# EAGLE design Basic_OCTA-MINI (EAGLE 8.1.0)

## Sheet 1 of 4
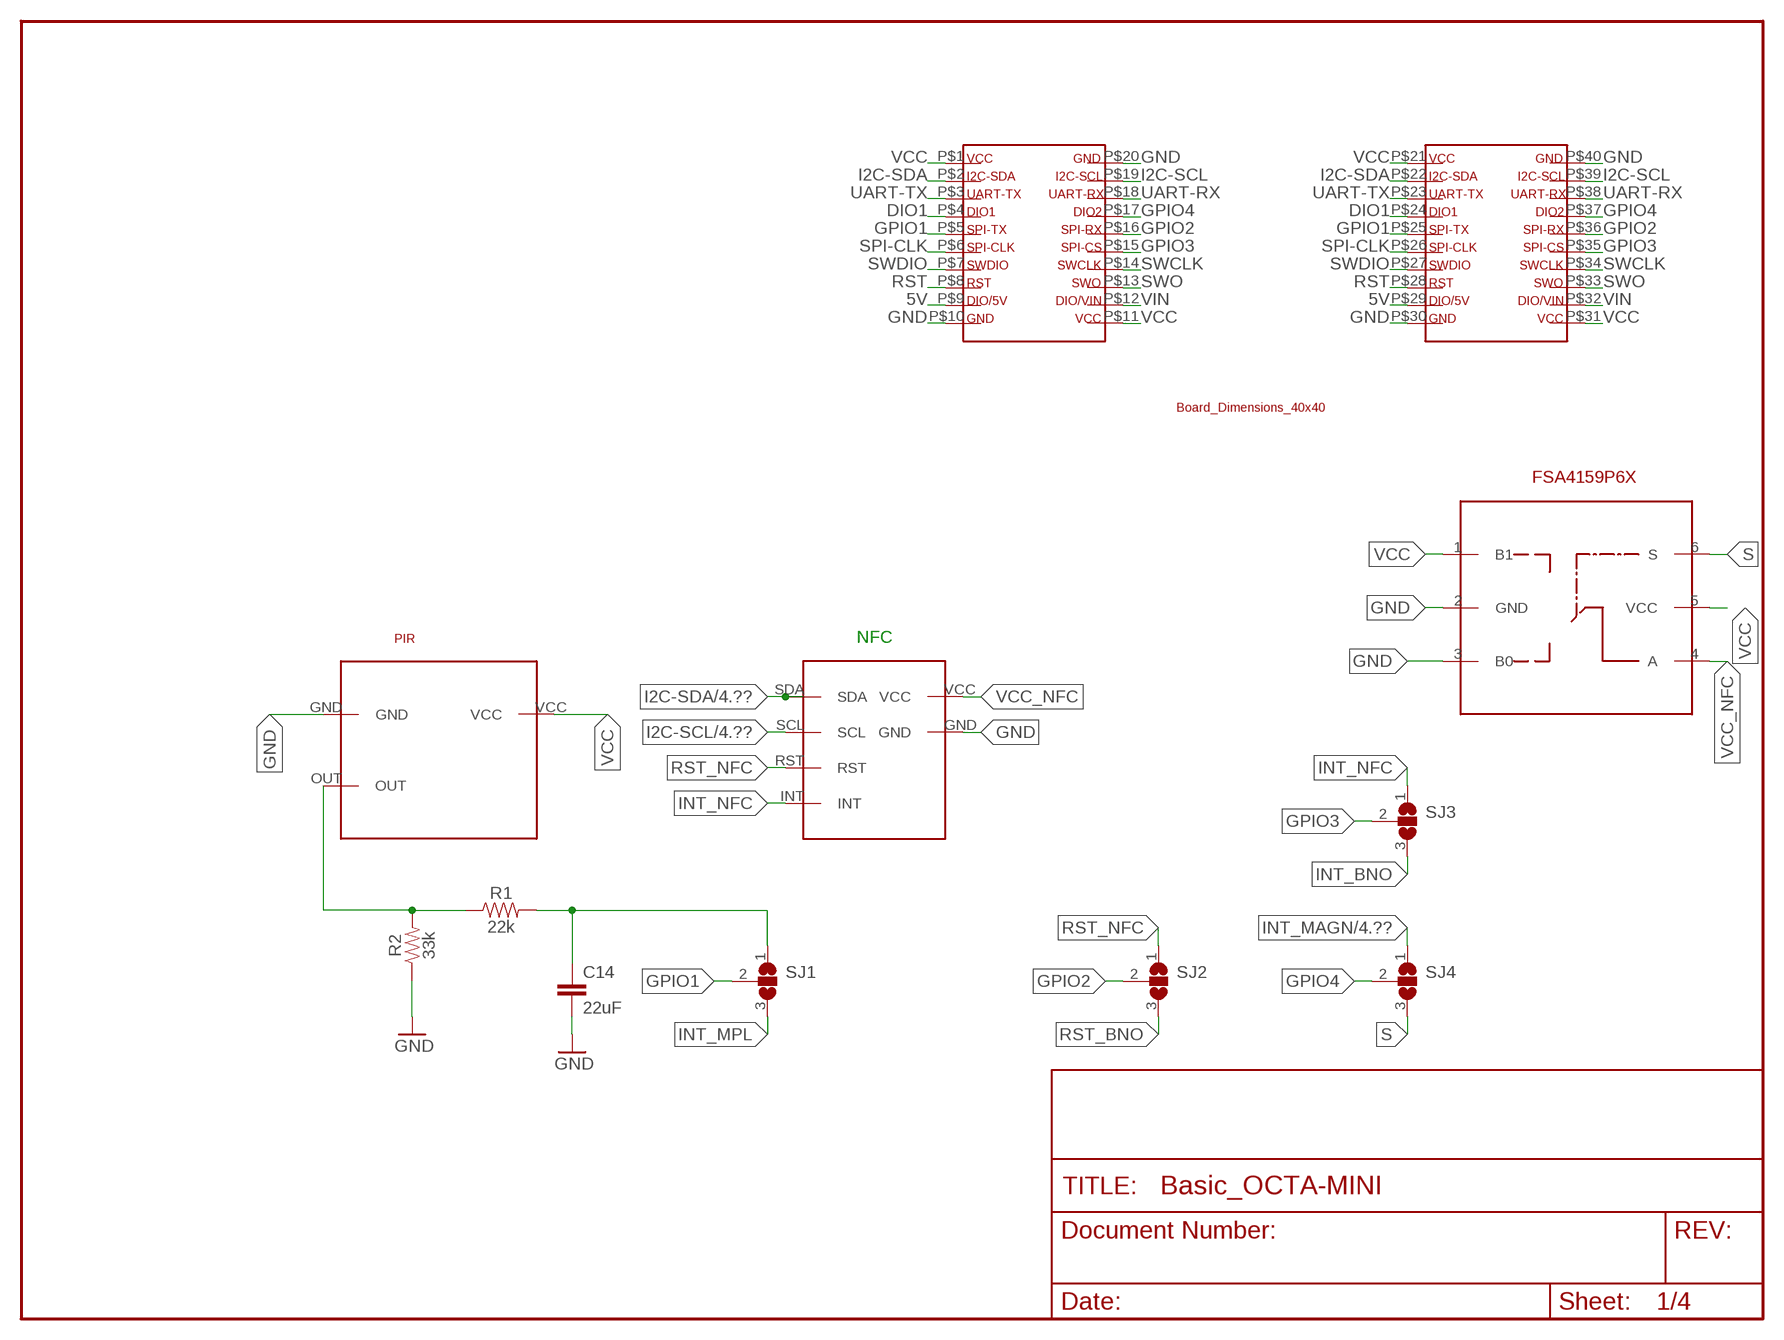
[diagram p0: schematic, sheet 1]

### Parts
C14  22uF  22UF-0805-6.3V-20%  [0805]
R1  22k  22KOHM-0603-1/10W-1%  [0603]
R2  33k  33KOHM-0603-1/10W-1%  [0603]
SJ1  SJ2W  [SJ_2]
SJ2  SJ2W  [SJ_2]
SJ3  SJ2W  [SJ_2]
SJ4  SJ2W  [SJ_2]
U$2  BOARD-DIMENSIONS-40X40  [BOARD-DIMENSIONS-40X40]
U$9  PIR  [PIR]
U$10  NFC  [NFC]
U$17  FSA4159P6X  [SOT65P210X100-6N]

### Nets
5V: U$2.P$9 U$2.P$29
DIO1: U$2.P$4 U$2.P$24
GND: C14.2 R2.1 U$2.P$10 U$2.P$20 U$2.P$30 U$2.P$40 U$9.GND U$10.GND U$17.2(GND) U$17.3(B0) ; also sheet 2,3,4
GPIO1: SJ1.2 U$2.P$5 U$2.P$25
GPIO2: SJ2.2 U$2.P$16 U$2.P$36
GPIO3: SJ3.2 U$2.P$15 U$2.P$35
GPIO4: SJ4.2 U$2.P$17 U$2.P$37
I2C-SCL: U$2.P$19 U$2.P$39 U$10.SCL ; also sheet 2,3,4
I2C-SDA: U$2.P$2 U$2.P$22 U$10.SDA ; also sheet 2,3,4
INT_BNO: SJ3.3 ; also sheet 2
INT_MAGN: SJ4.1 ; also sheet 4
INT_MPL: SJ1.3 ; also sheet 3
INT_NFC: SJ3.1 U$10.INT
N$7: R1.1 R2.2 U$9.OUT
OUT2_PIR: C14.1 R1.2 SJ1.1
RST: U$2.P$8 U$2.P$28
RST_BNO: SJ2.3 ; also sheet 2
RST_NFC: SJ2.1 U$10.RST
S: SJ4.3 U$17.6(S)
SPI-CLK: U$2.P$6 U$2.P$26
SWCLK: U$2.P$14 U$2.P$34
SWDIO: U$2.P$7 U$2.P$27
SWO: U$2.P$13 U$2.P$33
UART-RX: U$2.P$18 U$2.P$38
UART-TX: U$2.P$3 U$2.P$23
VCC: U$2.P$1 U$2.P$11 U$2.P$21 U$2.P$31 U$9.VCC U$17.1(B1) U$17.5(VCC) ; also sheet 2,3,4
VCC_NFC: U$10.VCC U$17.4(A)
VIN: U$2.P$12 U$2.P$32

### Notes on the sheet
- NFC

## Sheet 2 of 4
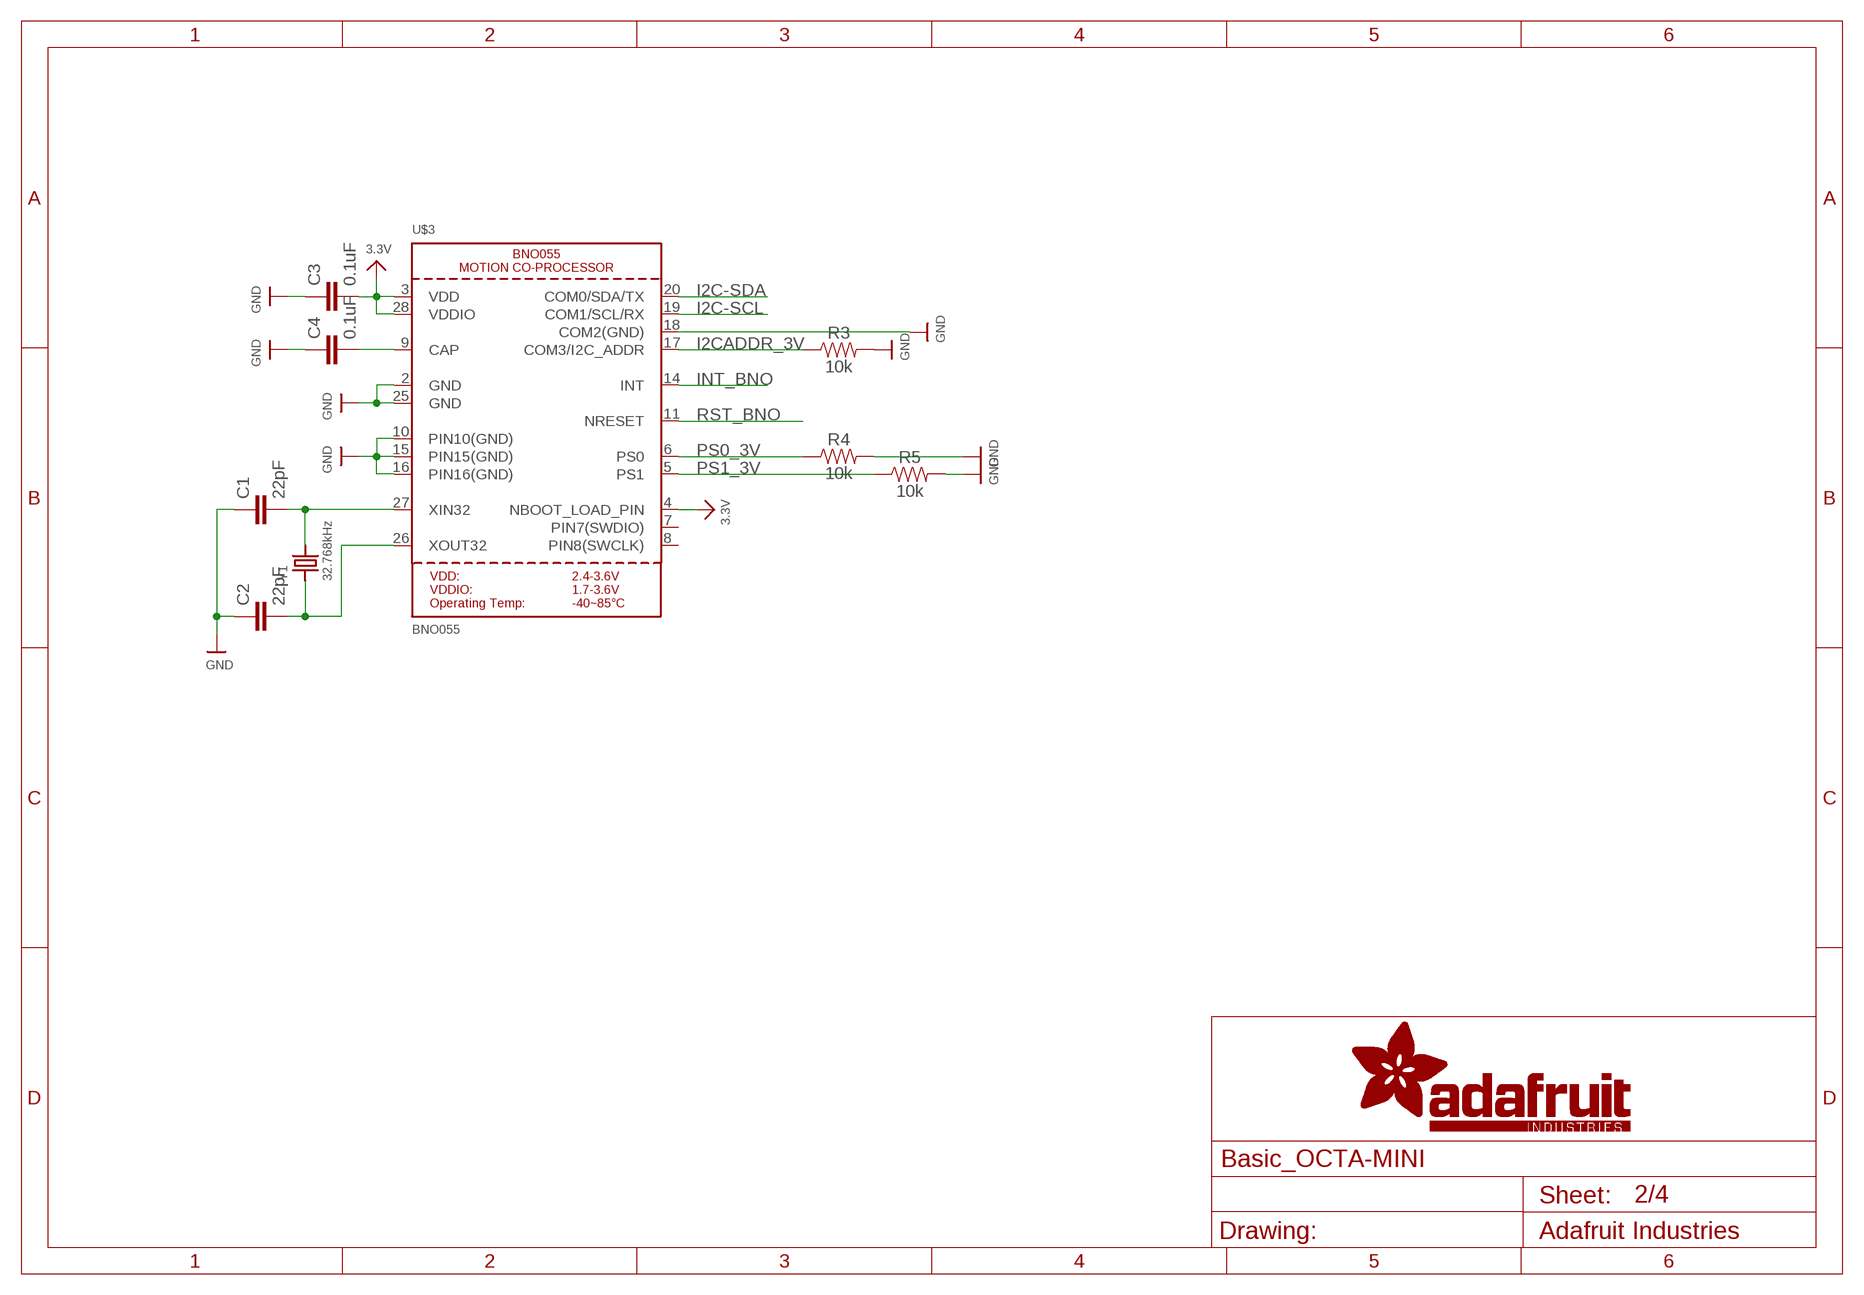
[diagram p1: schematic, sheet 2]

### Parts
C1  22pF  22PF-0603-50V-5%  [0603]
C2  22pF  22PF-0603-50V-5%  [0603]
C3  0.1uF  0.1UF-0603-25V-(+80/-20%)  [0603]
C4  0.1uF  0.1UF-0603-25V-(+80/-20%)  [0603]
R3  10k  10KOHM-0603-1/10W-1%  [0603]
R4  10k  10KOHM-0603-1/10W-1%  [0603]
R5  10k  10KOHM-0603-1/10W-1%  [0603]
U$3  BNO055  [BNO055]
Y1  32.768kHz  CRYSTAL8.0X3.8  [CRYSTAL_8X3.8]

### Nets
GND: C1.1 C2.1 C3.1 C4.1 R3.2 R4.2 R5.2 U$3.2(GND) U$3.10(PIN10(GND)) U$3.15(PIN15(GND)) U$3.16(PIN16(GND)) U$3.18(COM2(GND)) U$3.25(GND) ; also sheet 1,3,4
I2C-SCL: U$3.19(COM1/SCL/RX) ; also sheet 1,3,4
I2C-SDA: U$3.20(COM0/SDA/TX) ; also sheet 1,3,4
I2CADDR_3V: R3.1 U$3.17(COM3/I2C_ADDR)
INT_BNO: U$3.14(INT) ; also sheet 1
N$1: C1.2 U$3.27(XIN32) Y1.P$4
N$2: C2.2 U$3.26(XOUT32) Y1.P$1
N$3: C4.2 U$3.9(CAP)
PS0_3V: R4.1 U$3.6(PS0)
PS1_3V: R5.1 U$3.5(PS1)
RST_BNO: U$3.11(NRESET) ; also sheet 1
VCC: C3.2 U$3.3(VDD) U$3.4(NBOOT_LOAD_PIN) U$3.28(VDDIO) ; supply symbol labelled 3.3V ; also sheet 1,3,4
Unconnected: U$3.7(PIN7(SWDIO)) U$3.8(PIN8(SWCLK))

## Sheet 3 of 4
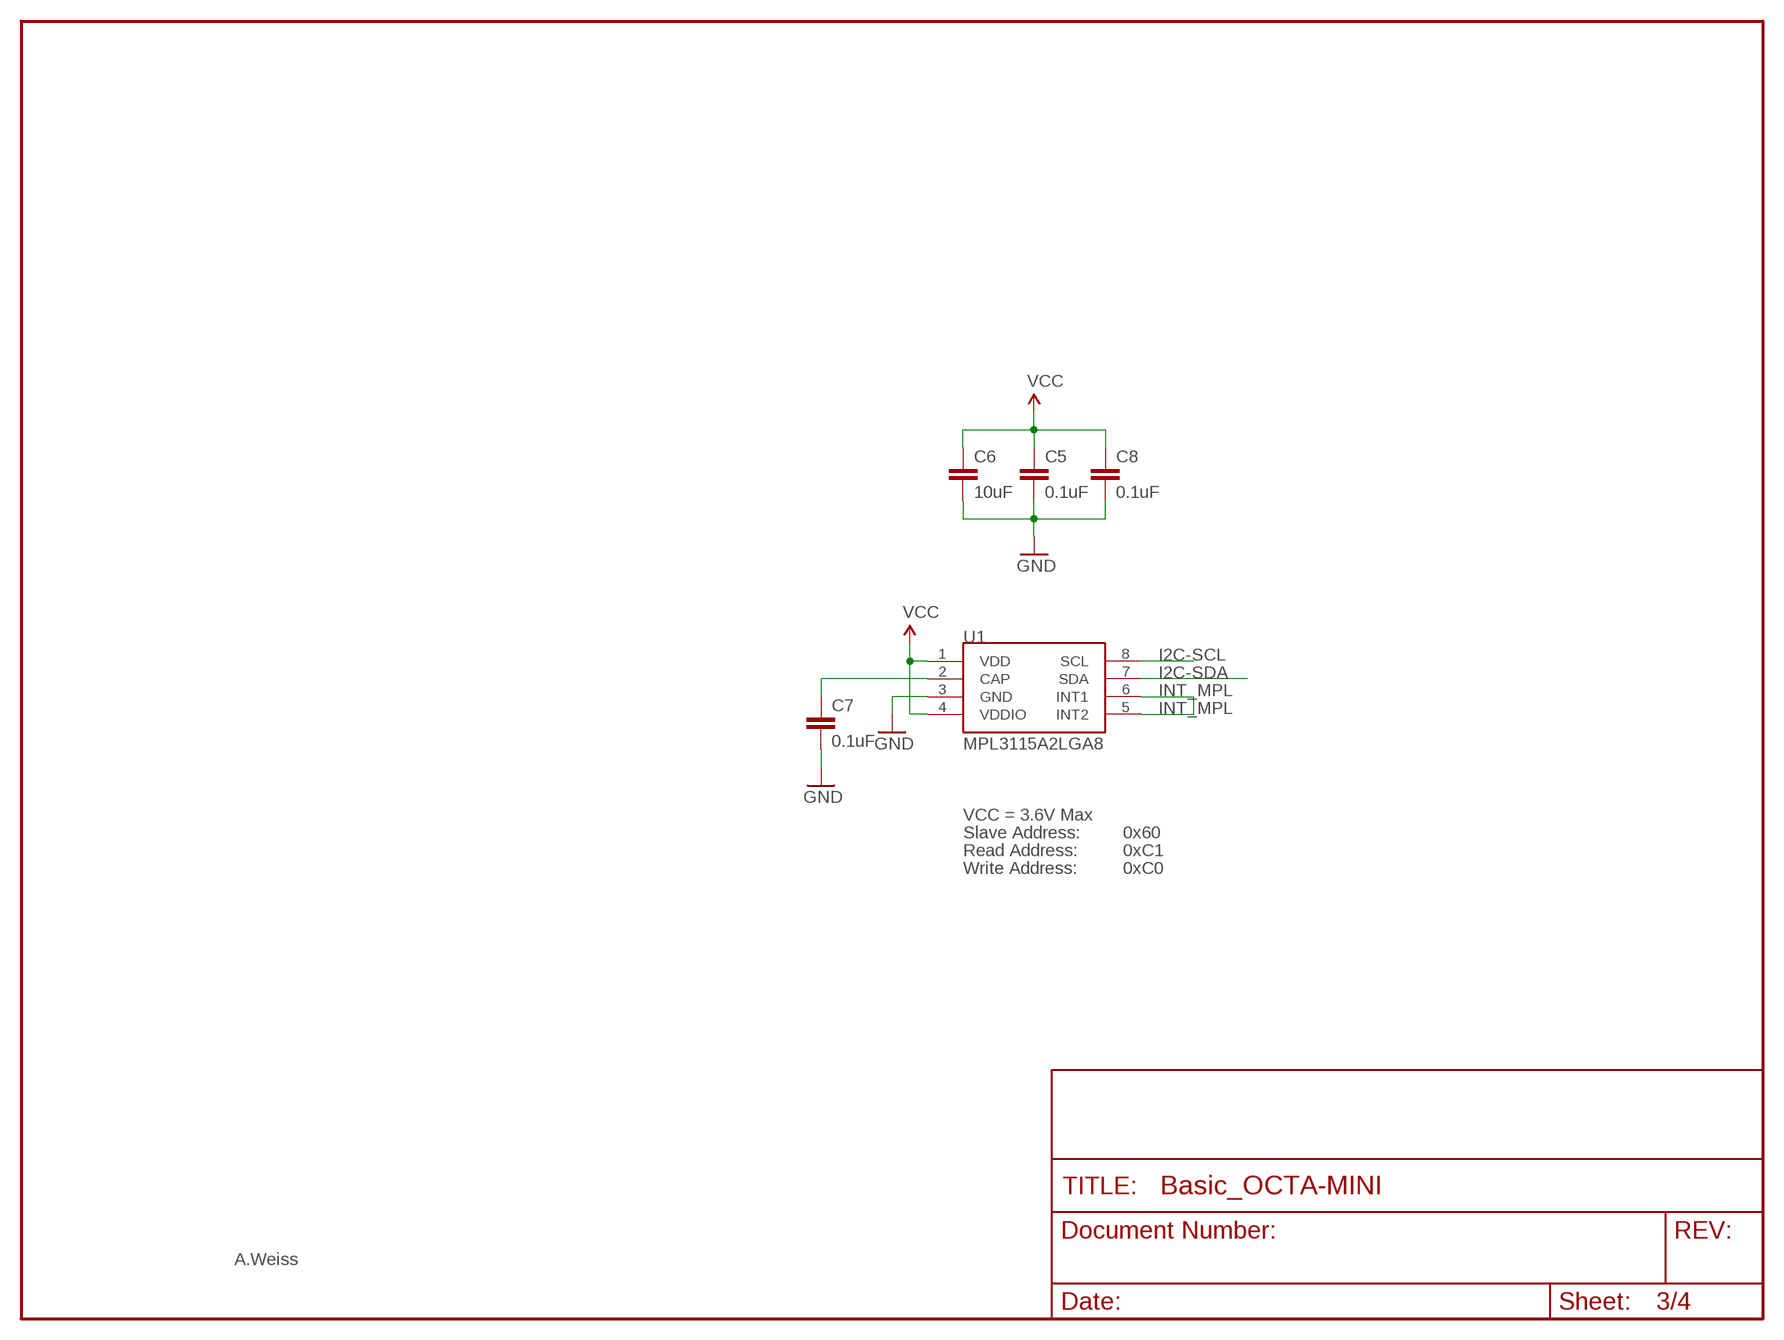
[diagram p2: schematic, sheet 3]

### Parts
C5  0.1uF  0.1UF-0603-25V-(+80/-20%)  [0603]
C6  10uF  10UF-0603-6.3V-20%  [0603]
C7  0.1uF  0.1UF-0603-25V-(+80/-20%)  [0603]
C8  0.1uF  0.1UF-0603-25V-(+80/-20%)  [0603]
U1  MPL3115A2LGA8  [LGA8]

### Nets
GND: C5.2 C6.2 C7.2 C8.2 U1.3(GND) ; also sheet 1,2,4
I2C-SCL: U1.8(SCL) ; also sheet 1,2,4
I2C-SDA: U1.7(SDA) ; also sheet 1,2,4
INT_MPL: U1.5(INT2) U1.6(INT1) ; also sheet 1
N$4: C7.1 U1.2(CAP)
VCC: C5.1 C6.1 C8.1 U1.1(VDD) U1.4(VDDIO) ; also sheet 1,2,4

### Notes on the sheet
- VCC = 3.6V Max
- Slave Address: | 0x60
- Read Address: | 0xC1
- Write Address: | 0xC0
- A.Weiss

## Sheet 4 of 4
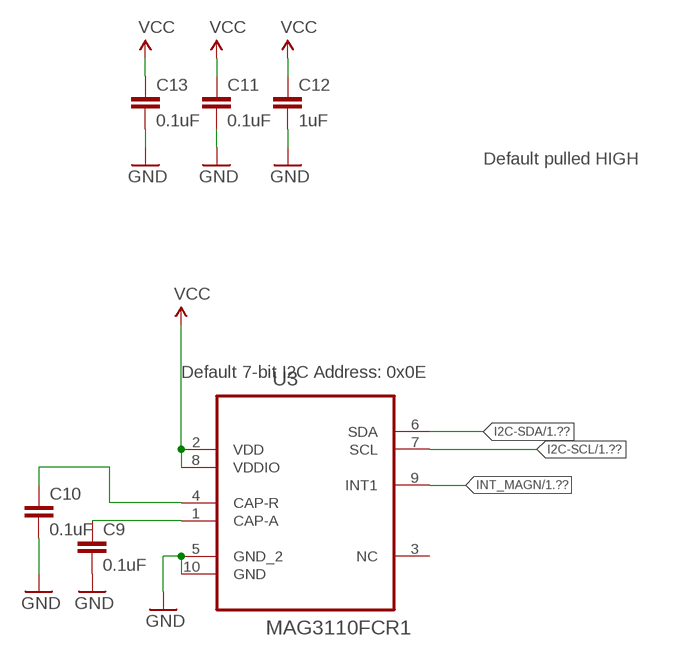
[diagram p3: schematic, sheet 4]

### Parts
C9  0.1uF  CAP0603-CAP  [0603-CAP]
C10  0.1uF  CAP0603-CAP  [0603-CAP]
C11  0.1uF  CAP0603-CAP  [0603-CAP]
C12  1uF  CAP0603-CAP  [0603-CAP]
C13  0.1uF  CAP0603-CAP  [0603-CAP]
U3  MAG3110FCR1  [DFN200X200X90-10N]

### Nets
GND: C9.2 C10.2 C11.2 C12.2 C13.2 U3.5(GND_2) U3.10(GND) ; also sheet 1,2,3
I2C-SCL: U3.7(SCL) ; also sheet 1,2,3
I2C-SDA: U3.6(SDA) ; also sheet 1,2,3
INT_MAGN: U3.9(INT1) ; also sheet 1
N$5: C10.1 U3.4(CAP-R)
N$6: C9.1 U3.1(CAP-A)
VCC: C11.1 C12.1 C13.1 U3.2(VDD) U3.8(VDDIO) ; also sheet 1,2,3
Unconnected: U3.3(NC)

### Notes on the sheet
- Default pulled HIGH
- Default 7-bit I2C Address: 0x0E

## Library data of the parts
C1 C2 = SparkFun-Capacitors:22PF: 22pF ceramic capacitors A capacitor is a passive two-terminal electrical component used to store electrical energy temporarily in an electric field.; PROD_ID: CAP-07876
C3-C5 C7 C8 = SparkFun-Capacitors:0.1UF: 0.1µF ceramic capacitors A capacitor is a passive two-terminal electrical component used to store electrical energy temporarily in an electric field.; PROD_ID: CAP-00810
C6 = SparkFun-Capacitors:10UF: 10.0µF ceramic capacitors A capacitor is a passive two-terminal electrical component used to store electrical energy temporarily in an electric field.; PROD_ID: CAP-11015
C9-C13 = SparkFun:CAP: Capacitor Standard 0603 ceramic capacitor, and 0.1" leaded capacitor.
C14 = SparkFun-Capacitors:22UF: 22µF ceramic capacitors A capacitor is a passive two-terminal electrical component used to store electrical energy temporarily in an electric field.; PROD_ID: CAP-08402
R1 = SparkFun-Resistors:22KOHM: 22kΩ resistor A resistor is a passive two-terminal electrical component that implements electrical resistance as a circuit element. Resistors act to reduce current flow, and, at the same time, act to lower voltage levels within circuits. - Wikipedia; PROD_ID: RES-07853
R2 = SparkFun-Resistors:33KOHM: 33kΩ resistor A resistor is a passive two-terminal electrical component that implements electrical resistance as a circuit element. Resistors act to reduce current flow, and, at the same time, act to lower voltage levels within circuits. - Wikipedia; PROD_ID: RES-08416
R3-R5 = SparkFun-Resistors:10KOHM: 10kΩ resistor A resistor is a passive two-terminal electrical component that implements electrical resistance as a circuit element. Resistors act to reduce current flow, and, at the same time, act to lower voltage levels within circuits. - Wikipedia; PROD_ID: RES-00824
SJ1-SJ4 = jumper:SJ2W: SMD solder JUMPER
U1 = SparkFun-Sensors:MPL3115A2: Altimeter/Pressure Sensor, I2C, 1.95V-3.6V supply, 50 to 110kPa
U3 = MAG3110FCR:MAG3110FCR1: MAGNETOMETER, 3AXIS, I2C, 80HZ,DFN-10; MPN: MAG3110FCR1; OC_FARNELL: 2080492; OC_NEWARK: 07W3591; PACKAGE: DFN-10; SUPPLIER: FREESCALE SEMICONDUCTOR
U$2 = OCTA-CORE:BOARD-DIMENSIONS-40X40
U$3 = microbuilder:BNO055: BNO055 - Motion Co-Processor
U$9 = untitled1:PIR
U$10 = untitled1:NFC
U$17 = FSA4159P6X:FSA4159P6X
Y1 = microbuilder:CRYSTAL: Crystals HC49UP - Surface Mount Crystal 4.0MHz 18pF +/-30ppm Surface Mount Crystal [Digikey: 535-9857-1-ND] 12.0 MHz Surface Mount Crystal [Digikey: 535-9869-6-ND] 25.0 MHz Surface Mount Crystal [Digikey: 535-9078-1-ND] 2.5 x 2.0mm - MEMs SMT Crystal 16.0 MHz 10pF 20ppm 2.5 x 2.0mm Crystal [Digikey -40-85°C: 535-10923-1-ND] 3.2 x 2.5mm - MEMs SMT Crystal 12.0 MHz 8pF 15ppm 3.2 x 2.5mm Crystal [Digikey: -10-70°C: 644-1047-1-ND -40-125°C: 644-1128-1-ND] 40~85°C cheaper: 644-1173-6-ND 16.0 MHz 8pF 15ppm 3.2 x 2.5mm Crystal [Digikey: -10-70°C: 644-1049-1-ND -40-125°C: 644-1129-2-ND]-40~85°C cheaper: 644-1175-6-ND 16.0 MHz 10pF 10ppm 3.2 x 2.5mm Crystal [Digikey: 644-1100-1-ND] 27.12 MHz 18pF 30ppm 3.2 x 2.5mm Crystal [Digikey: 887-1424-1-ND] 27.12MHz 10pF 10ppm 3.2 x 2.5mm Crystal [Digikey: 887-1329-1-ND] 4.9 x 1.8mm - MEMs SMT Crystal 32.768 KHz 12.5pF 20ppm 4.9 x 1.8mm Crystal [Digikey: SE2415CT-ND] 8.0 x 3.8mm - Surface Mount Crystal 32.768kHz 12.5pF 20ppm -40°C-85°C [Digikey: 535-9166-2-ND] Cylinder 32.768KHz Cylinder Crystal (2x6mm body) [Ex. Digikey: 300-8341-2-ND]

## Board
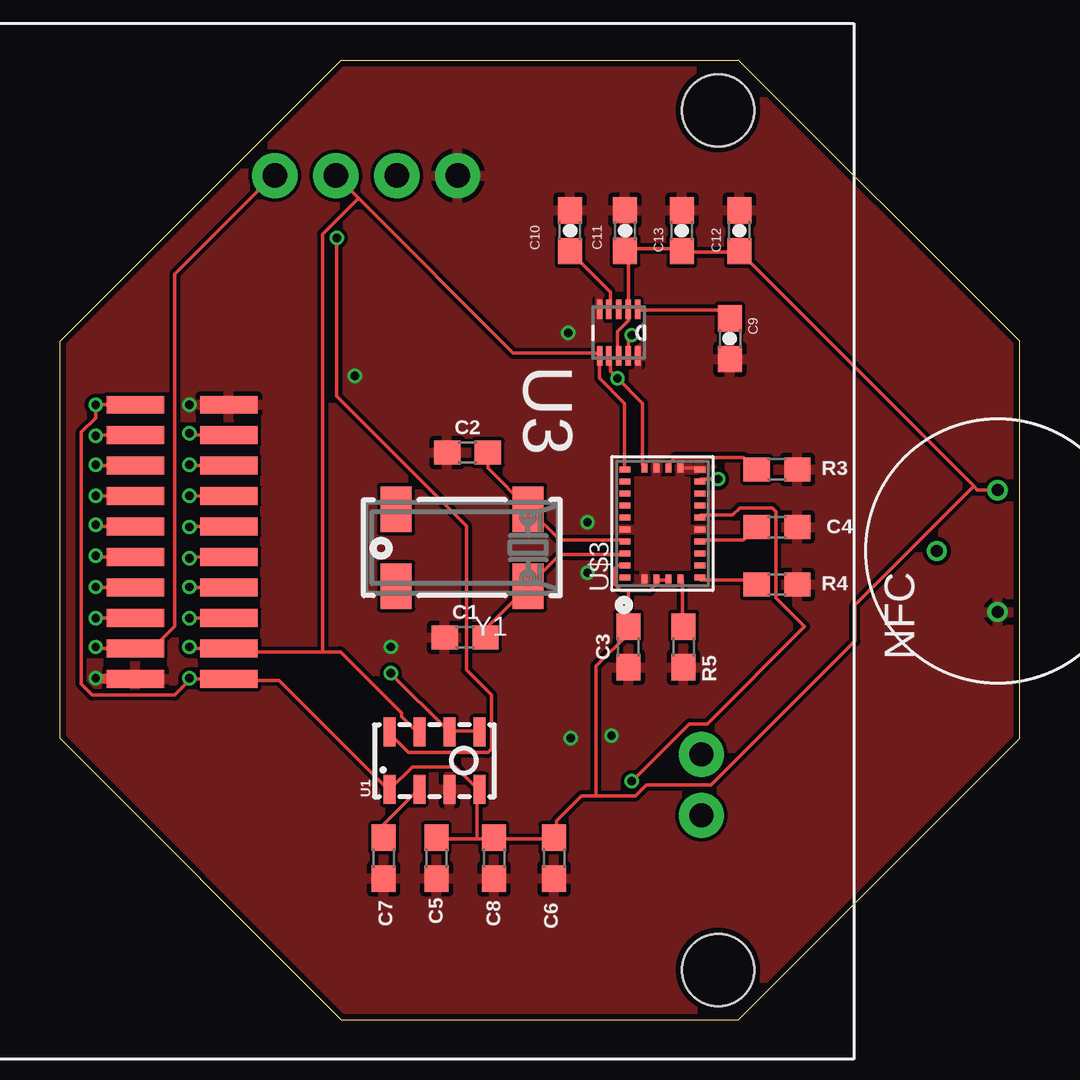
[diagram p4: board, top side]
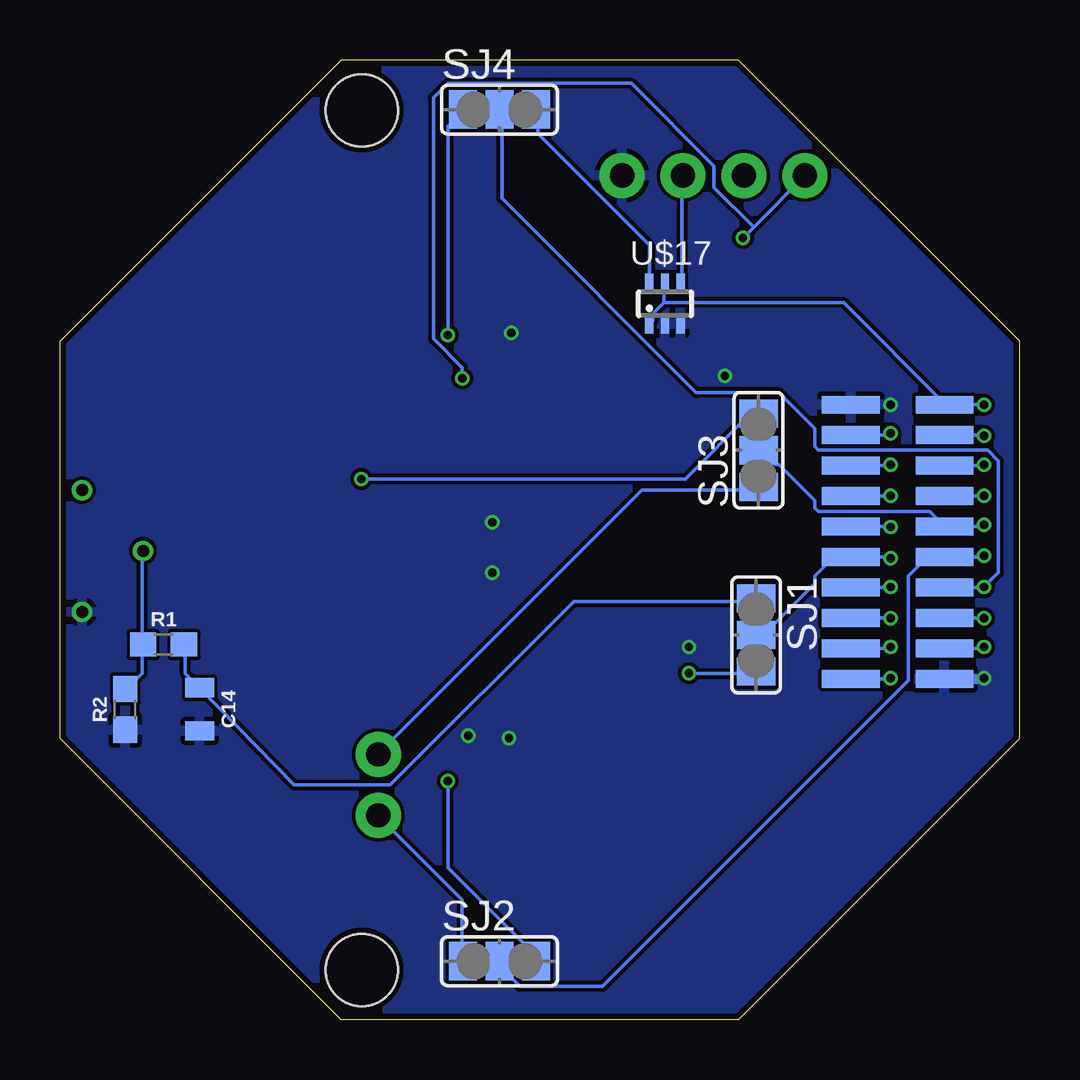
[diagram p5: board, bottom side, seen from below]

Size 40.01 x 40 mm. Coordinates in mm from the lower left corner, seen from the top.
Copper layers (1*16): Top 0.018mm / dielectric 1.55mm / Bottom 0.018mm
Design rules "eC_2Layer_PClass6_BaseCopperO18_eCDefault": minimum track width 0.15mm, minimum drill 0.35mm, track to track 0.15mm, track to pad 0.15mm, pad to pad 0.15mm, via to via 0.15mm, smd to smd 0mil, copper to edge 0.25mm, drill to drill 0.35mm, minimum pad ring 0.175mm, minimum via ring 0.125mm, stop-mask expansion 0mil, vias tented up to drill 0.45mm, thermal gap 0.2mm

### Footprints (pad centres in the part's own frame; a part is rotated, then mirrored left to right if it is on the bottom)
0603 = smd 1.1 x 1: 1 -0.85,0; 2 0.85,0
0603-CAP = smd 1.1 x 1: 1 -0.85,0; 2 0.85,0
0805 = smd 0.8 x 1.2: 1 -0.9,0; 2 0.9,0
SJ_2 = smd 1.168 x 1.6: 1 -1.524,0; 2 0,0; 3 1.524,0
LGA8 = smd 1.2 x 0.5: 1 -1.2,1.875; 2 -1.2,0.625; 3 -1.2,-0.625; 4 -1.2,-1.875; 5 1.2,-1.875; 6 1.2,-0.625; 7 1.2,0.625; 8 1.2,1.875
DFN200X200X90-10N = smd 0.813 x 0.229: 1 -0.965,0.787; 2 -0.965,0.406; 3 -0.965,0; 4 -0.965,-0.406; 5 -0.965,-0.787; 6 0.965,-0.787; 7 0.965,-0.406; 8 0.965,0; 9 0.965,0.406; 10 0.965,0.787
BOARD-DIMENSIONS-40X40 = smd 2.4 x 0.74: P$1 7.05,2.47; P$2 7.05,3.74; P$3 7.05,5.01; P$4 7.05,6.28; P$5 7.05,7.55; P$6 7.05,8.82; P$7 7.05,10.09; P$8 7.05,11.36; P$9 7.05,12.63; P$10 7.05,13.9; P$11 3.15,13.9; P$12 3.15,12.63; P$13 3.15,11.36; P$14 3.15,10.09; P$15 3.15,8.82; P$16 3.15,7.55; P$17 3.15,6.28; P$18 3.15,5.01; P$19 3.15,3.74; P$20 3.15,2.47 | smd 2.4 x 0.74 bottom: P$21 7.05,2.47; P$22 7.05,3.74; P$23 7.05,5.01; P$24 7.05,6.28; P$25 7.05,7.55; P$26 7.05,8.82; P$27 7.05,10.09; P$28 7.05,11.36; P$29 7.05,12.63; P$30 7.05,13.9; P$31 3.15,13.9; P$32 3.15,12.63; P$33 3.15,11.36; P$34 3.15,10.09; P$35 3.15,8.82; P$36 3.15,7.55; P$37 3.15,6.28; P$38 3.15,5.01; P$39 3.15,3.74; P$40 3.15,2.47 | hole 3: 27.44,26.17; 27.44,-9.66
BNO055 = smd 0.25 x 0.475: 1 -2.25,1.562; 6 -2.25,-1.562; 7 -1.75,-1.562; 8 -1.25,-1.562; 9 -0.75,-1.562; 10 -0.25,-1.562; 11 0.25,-1.562; 12 0.75,-1.562; 13 1.25,-1.562; 14 1.75,-1.562; 15 2.25,-1.562; 20 2.25,1.562; 21 1.75,1.562; 22 1.25,1.562; 23 0.75,1.562; 24 0.25,1.562; 25 -0.25,1.562; 26 -0.75,1.562; 27 -1.25,1.562; 28 -1.75,1.562 | smd 0.375 x 0.25: 2 -2.312,0.75; 3 -2.312,0.25; 4 -2.312,-0.25; 5 -2.312,-0.75; 16 2.312,-0.75; 17 2.312,-0.25; 18 2.312,0.25; 19 2.312,0.75
PIR = drill 0.5: GND 2.54,0; OUT 0,-2.54; VCC -2.54,0
NFC = drill 1.016 pad 1.88: GND 6.35,-16.51; INT 30.48,-6.35; RST 33.02,-6.35; SCL 6.35,-24.13; SDA 6.35,-21.59; VCC 6.35,-19.05
SOT65P210X100-6N = smd 0.35 x 0.8: 1 -0.65,-0.836; 2 0,-0.836; 3 0.65,-0.836; 4 0.65,0.864; 5 0,0.864; 6 -0.65,0.864
CRYSTAL_8X3.8 = smd 1.3 x 1.9: P$1 -2.75,-1.6; P$2 2.75,-1.6; P$3 2.75,1.6; P$4 -2.75,1.6

### Placement (x,y rotation side)
C1  16.89,15.93 0 top
C2  16.99,23.63 0 top
C3  23.69,15.53 90 top
C4  29.89,20.53 180 top
C5  15.69,6.73 270 top
C6  20.59,6.73 270 top
C7  13.49,6.73 270 top
C8  18.09,6.73 270 top
C9  27.93,28.38 270 top
C10  21.26,32.88 90 top
C11  23.56,32.89 90 top
C12  28.32,32.88 90 top
C13  25.92,32.88 90 top
C14  34.19,12.93 270 bottom
R1  35.69,15.63 0 bottom
R2  37.29,12.93 90 bottom
R3  29.89,22.93 0 top
R4  29.89,18.13 0 top
R5  25.99,15.53 270 top
SJ1  10.99,16.03 270 bottom
SJ2  21.69,2.43 0 bottom
SJ3  10.89,23.73 90 bottom
SJ4  21.69,37.93 0 bottom
U1  15.61,10.79 90 top
U3  23.29,28.63 270 top
U$2  -0.01,11.73 0 top
U$3  25.11,20.68 90 top
U$9  39.09,19.53 270 top
U$10  33.09,41.53 270 top
U$17  14.79,29.83 0 bottom
Y1  16.76,19.67 180 top

### Tracks (layer width: path | path; a pad name or v marks a point on that pad's centre or on a via)
5V  (via drill 0.35)
  Top 0.15: U$2.P$29 5.39,24.36 v5.39,24.43
  Bottom 0.15: U$2.P$29 5.39,24.36 v5.39,24.43
DIO1  (via drill 0.35)
  Top 0.15: U$2.P$24 5.39,18.01 v5.39,18.03
  Bottom 0.15: U$2.P$24 5.39,18.01 v5.39,18.03
GND  (via drill 0.35)
  Top 0.15: U$3.16 26.68,22.99 U$3.15
  Top 0.406: U$2.P$40 1.49,14.2 v1.49,14.23
  Bottom 0.406: U$2.P$40 1.49,14.2 v1.49,14.23
  other vias: 5.39,25.63 12.29,26.83 21.19,28.63 21.99,20.73 21.99,18.63 22.99,11.83 21.29,11.73 13.79,15.53
  pour Bottom: 11.69,40.03 28.29,40.03 39.99,28.33 39.99,11.73 28.29,0.03 11.69,0.03 -0.01,11.73 -0.01,28.23 11.69,39.93
  pour Top: 11.79,40.03 28.29,40.03 39.99,28.33 39.99,11.73 28.29,0.03 11.69,0.03 -0.01,11.73 -0.01,28.23 11.69,39.93 11.69,40.03
GPIO1  (via drill 0.35)
  Top 0.15: U$2.P$25 5.39,19.28 v5.39,19.23
  Bottom 0.15: v5.39,19.23 5.39,19.28 U$2.P$25 7.04,19.23 7.79,19.23 8.54,18.48 8.54,18.18 10.64,16.08 10.94,16.08 SJ1.2
GPIO2  (via drill 0.35)
  Top 0.15: U$2.P$36 1.49,19.28 v1.49,19.33
  Bottom 0.15: v1.49,19.33 1.49,19.28 U$2.P$36 3.14,19.23 3.89,19.23 4.64,18.48 4.64,14.13 17.39,1.38 20.84,1.38 21.59,2.13 21.59,2.43 SJ2.2
GPIO3  (via drill 0.35)
  Top 0.15: U$2.P$35 1.49,20.55 v1.49,20.63
  Bottom 0.15: v1.49,20.63 1.49,20.55 U$2.P$35 3.14,20.58 3.74,21.18 8.39,21.18 8.54,21.33 8.54,21.63 10.04,23.13 10.19,23.13 10.79,23.73 SJ3.2
GPIO4  (via drill 0.35)
  Top 0.15: U$2.P$37 1.49,18.01 v1.49,18.03
  Bottom 0.15: U$2.P$37 1.49,18.01 v1.49,18.03 0.89,18.63 0.89,23.28 1.34,23.73 8.39,23.73 8.54,23.88 8.54,24.63 10.04,26.13 13.49,26.13 21.59,34.23 21.59,37.83 SJ4.2
I2C-SCL  (via drill 0.35)
  Top 0.15: v1.49,15.53 1.49,15.47 U$2.P$39 3.89,15.48 4.79,16.38 4.79,31.08 8.84,35.13 U$10.SCL | U$3.19 24.29,23.13 24.29,25.68 v23.24,26.73 22.94,27.03 22.94,27.63 U3.7 | v11.54,32.58 11.54,25.98 16.94,20.58 16.94,14.58 17.99,13.53 17.99,11.28 17.84,11.13 14.54,11.13 13.79,11.88 U1.8
  Bottom 0.15: U$2.P$39 1.49,15.47 v1.49,15.53 | 11.09,33.03 8.99,35.13 U$10.SCL | 11.09,33.03 v11.54,32.58 | v23.24,26.73 23.24,27.18 24.44,28.38 24.44,38.43 23.84,39.03 16.19,39.03 12.74,35.58 12.74,34.68 11.09,33.03
I2C-SDA  (via drill 0.35)
  Top 0.15: v5.39,15.53 5.39,15.47 U$2.P$22 7.04,15.33 10.94,15.33 | 10.94,15.33 11.69,15.33 14.24,12.78 14.24,12.63 14.84,12.03 U1.7 | U$3.20 23.54,22.98 23.54,25.68 22.49,26.73 22.49,27.63 U3.6 22.49,27.78 18.89,27.78 12.44,34.23 | 12.44,34.23 11.54,35.13 U$10.SDA | 10.94,15.33 10.94,32.73 12.44,34.23
  Bottom 0.15: U$2.P$22 5.39,15.47 v5.39,15.53
I2CADDR_3V
  Top 0.15: U$3.17 25.34,23.13 25.64,23.43 28.49,23.43 28.94,22.98 R3.1
INT_BNO  (via drill 0.35)
  Top 0.15: v27.44,22.53 26.69,22.53 U$3.14
  Bottom 0.15: v27.44,22.53 13.94,22.53 11.24,25.23 10.94,25.23 SJ3.3
INT_MAGN  (via drill 0.35)
  Top 0.15: v23.84,28.53 23.69,28.38 23.69,27.78 U3.9
  Bottom 0.15: v23.84,28.53 23.84,37.23 23.24,37.83 SJ4.1
INT_MPL  (via drill 0.35)
  Top 0.15: U1.5 17.39,12.03 16.34,12.03 U1.6 16.19,12.03 v13.79,14.43
  Bottom 0.15: v13.79,14.43 11.09,14.43 SJ1.3
INT_NFC
  Bottom 0.15: SJ3.1 10.94,22.08 15.74,22.08 26.69,11.13 U$10.INT
N$1
  Top 0.15: U$3.27 23.54,19.38 20.84,19.38 19.64,18.18 Y1.P$4 19.49,18.03 17.84,16.38 17.84,15.93 C1.2
N$2
  Top 0.15: U$3.26 23.54,19.98 20.84,19.98 19.64,21.18 Y1.P$1 19.49,21.33 17.84,22.98 C2.2
N$3
  Top 0.15: C4.2 28.49,19.98 26.69,19.98 U$3.9
N$4
  Top 0.15: U1.2 14.84,9.48 13.49,8.13 C7.1
N$5
  Top 0.15: U3.4 22.94,29.73 22.94,30.33 21.29,31.98 C10.1
N$6
  Top 0.15: U3.1 24.14,29.58 27.59,29.58 27.89,29.28 C9.1
N$7
  Bottom 0.15: 36.59,15.63 36.59,14.43 37.19,13.83 R2.2 | 36.59,15.63 36.59,19.53 U$9.OUT | 36.59,15.63 R1.1
OUT2_PIR
  Bottom 0.15: SJ1.1 11.09,17.43 18.59,17.43 26.24,9.78 30.24,9.78 C14.1 34.79,14.43 34.79,15.63 R1.2
PS0_3V
  Top 0.15: U$3.6 26.69,18.33 28.79,18.33 28.94,18.18 R4.1
PS1_3V
  Top 0.15: U$3.5 25.94,18.33 25.94,16.38 R5.1
RST  (via drill 0.35)
  Top 0.15: U$2.P$28 5.39,23.09 v5.39,23.13
  Bottom 0.15: U$2.P$28 5.39,23.09 v5.39,23.13
RST_BNO  (via drill 0.35)
  Top 0.15: v23.84,9.93 26.24,12.33 26.99,12.33 31.04,16.38 29.84,17.58 29.84,21.18 29.69,21.33 28.34,21.33 28.04,21.03 26.69,21.03 U$3.11
  Bottom 0.15: v23.84,9.93 23.84,6.33 20.24,2.73 20.24,2.43 SJ2.3
RST_NFC
  Bottom 0.15: SJ2.1 23.24,2.43 23.24,4.98 26.69,8.43 U$10.RST
S
  Bottom 0.15: U$17.6 15.44,30.78 15.44,32.28 20.09,36.93 20.09,37.83 SJ4.3
SPI-CLK  (via drill 0.35)
  Top 0.15: U$2.P$26 5.39,20.55 v5.39,20.53
  Bottom 0.15: U$2.P$26 5.39,20.55 v5.39,20.53
SWCLK  (via drill 0.35)
  Top 0.15: U$2.P$34 v1.49,21.82 v1.49,21.83
  Bottom 0.15: U$2.P$34 v1.49,21.82 v1.49,21.83
SWDIO  (via drill 0.35)
  Top 0.15: U$2.P$27 v5.39,21.82 v5.39,21.83
  Bottom 0.15: U$2.P$27 v5.39,21.82 v5.39,21.83
SWO  (via drill 0.35)
  Top 0.15: U$2.P$33 1.49,23.09 v1.49,23.13
  Bottom 0.15: U$2.P$33 1.49,23.09 v1.49,23.13
UART-RX  (via drill 0.35)
  Top 0.15: U$2.P$38 v1.49,16.74 v1.49,16.73
  Bottom 0.15: U$2.P$38 v1.49,16.74 v1.49,16.73
UART-TX  (via drill 0.35)
  Top 0.15: U$2.P$23 v5.39,16.74 v5.39,16.73
  Bottom 0.15: U$2.P$23 v5.39,16.74 v5.39,16.73
VCC  (via drill 0.35)
  Top 0.15: U$2.P$31 v1.49,25.63 1.49,25.08 0.89,24.48 0.89,13.98 1.34,13.53 4.79,13.53 5.39,14.13 v5.39,14.23 5.39,14.2 U$2.P$21 7.04,14.13 9.14,14.13 13.64,9.63 U1.1 13.79,9.63 14.69,10.53 16.49,10.53 17.39,9.63 U1.4 | U3.8 23.24,27.78 23.24,28.68 23.69,29.13 23.69,29.58 U3.2 23.69,29.73 23.69,31.98 C11.1 23.69,32.13 25.79,32.13 C13.1 25.94,31.98 28.19,31.98 C12.1 28.34,31.98 38.09,22.23 | 38.09,22.23 38.24,22.08 38.99,22.08 U$9.VCC | 25.04,18.33 25.34,18.33 U$3.4 | 25.04,18.33 24.89,18.33 U$3.3 | 23.69,17.88 24.59,17.88 25.04,18.33 | 23.69,17.88 23.39,17.88 23.09,18.18 23.09,18.78 23.24,18.93 U$3.28 | 17.54,9.48 U1.4 | 38.09,22.23 33.14,17.28 33.14,15.78 27.14,9.78 24.44,9.78 23.99,9.33 22.34,9.33 | 22.34,9.33 21.74,9.33 20.69,8.28 20.69,7.68 C6.1 20.54,7.53 18.14,7.53 C8.1 17.99,7.53 17.39,7.53 | 23.69,17.88 C3.2 23.69,16.08 22.34,14.73 22.34,9.33 | 17.39,7.53 15.74,7.53 C5.1 | 17.39,7.53 17.39,9.48 U1.4
  Bottom 0.15: v1.49,25.63 U$2.P$31 3.14,25.68 7.34,29.88 14.84,29.88 | U$2.P$21 5.39,14.2 v5.39,14.23 | 14.84,29.88 14.84,30.63 U$17.5 | 14.84,29.88 15.29,29.43 15.29,29.13 U$17.1
VCC_NFC
  Bottom 0.15: U$17.4 14.09,30.78 14.09,35.13 U$10.VCC
VIN  (via drill 0.35)
  Top 0.15: U$2.P$32 1.49,24.36 v1.49,24.33
  Bottom 0.15: U$2.P$32 1.49,24.36 v1.49,24.33